# EAGLE schematic EEZ CF-DIC r4B4 (EAGLE 7.2.0)
Assembly variants: Farnell, TME

## Sheet 1 of 3
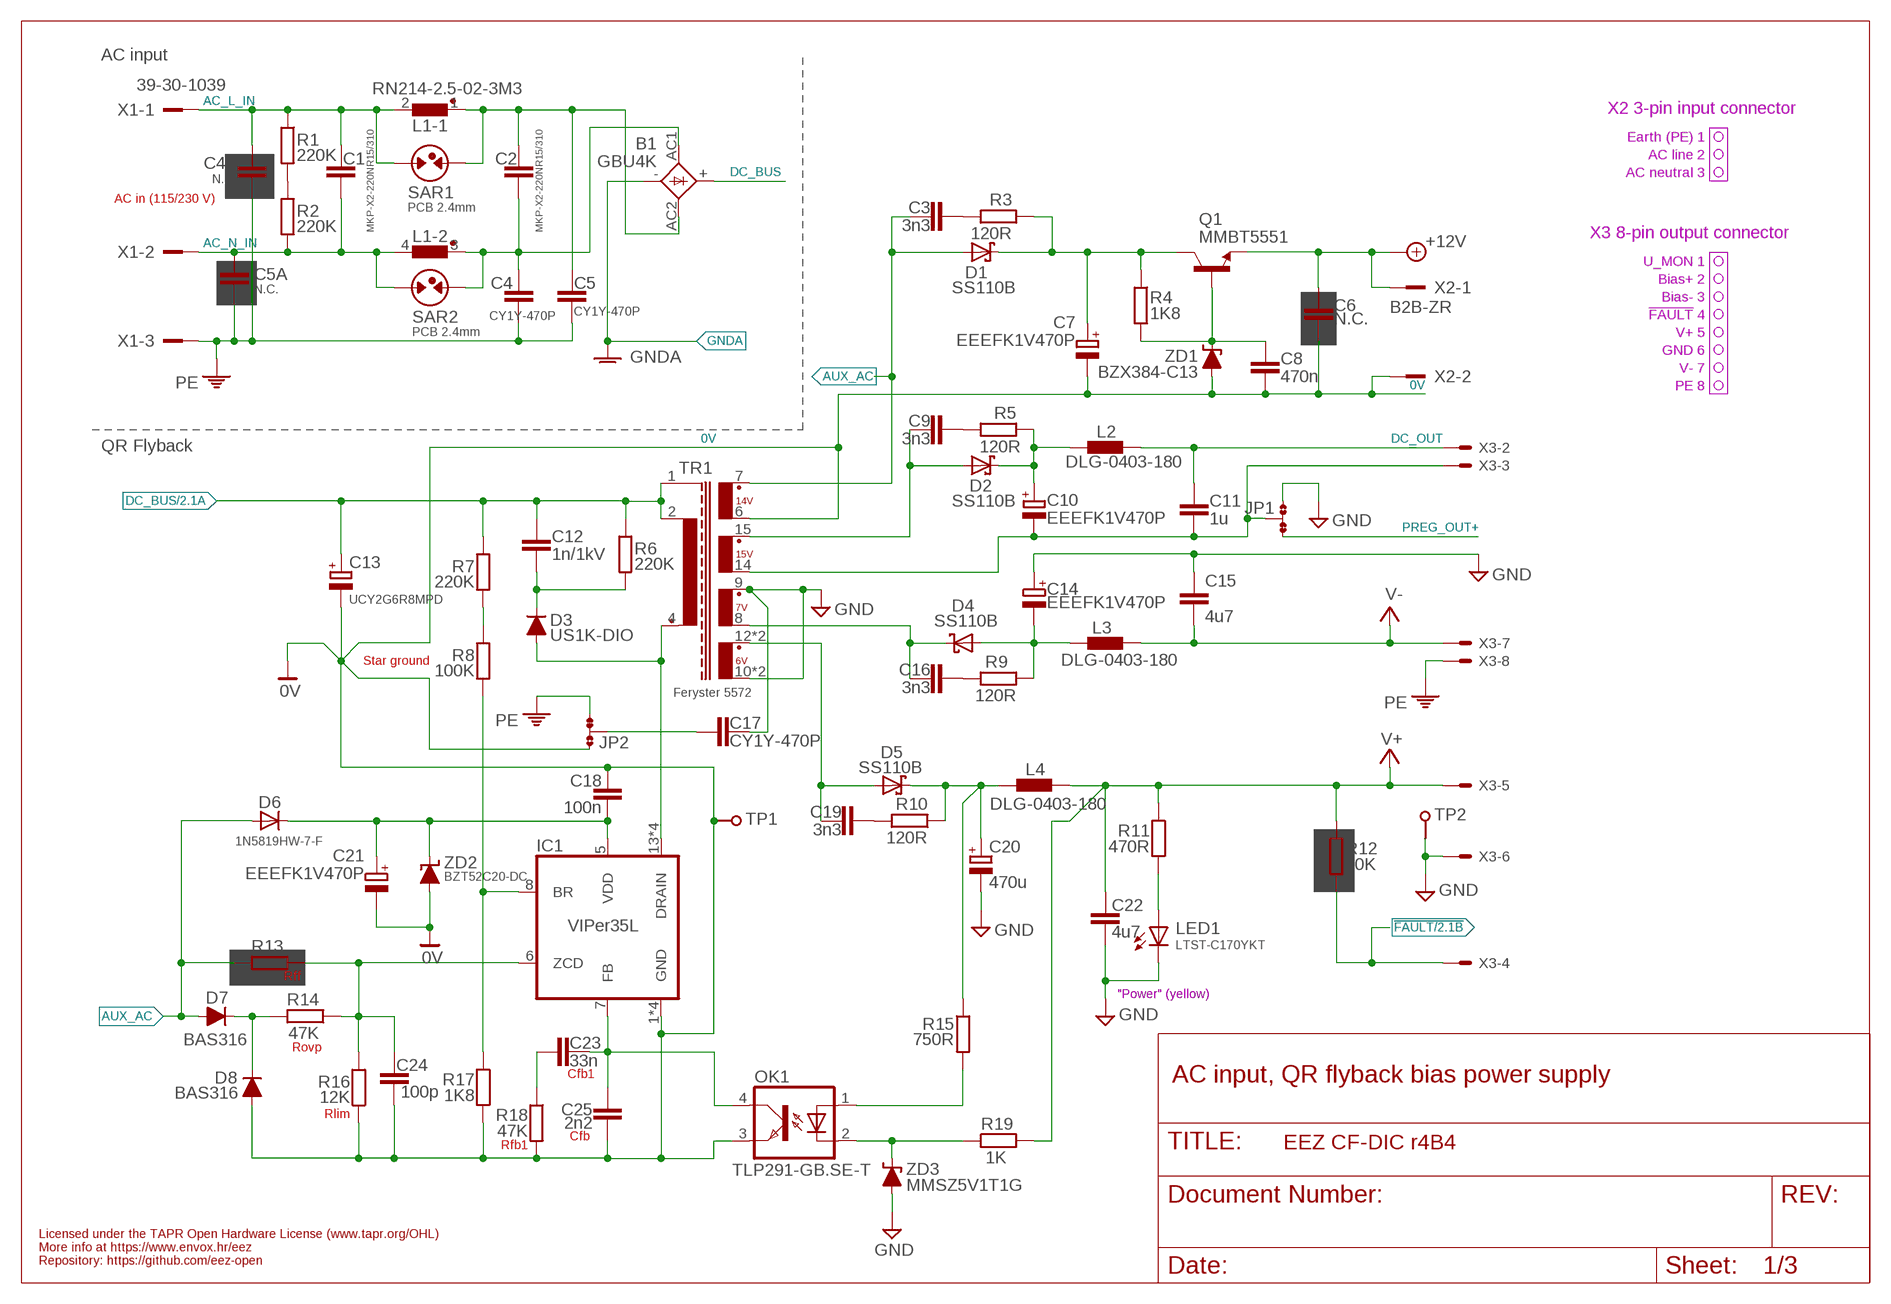
[diagram p0: schematic, sheet 1]

### Parts
B1  GBU4K  BRIDGE-CREEPAGE  [GBU4K_CRE]
C1  MKP-X2-220NR15/310  C-EU150-072X183  [C150-072X183]
C2  MKP-X2-220NR15/310  C-EU150-072X183  [C150-072X183]
C3  3n3  C-EUC0805  [C0805]
C4  CY1Y-470P  C-EUCY  [CY075-032X103]
C4A  N.C.  C-EUCY  [CY075-032X103]
C5  CY1Y-470P  C-EUCY  [CY075-032X103]
C5A  N.C.  C-EUCY  [CY075-032X103]
C6  N.C.  C-EUC0603  [C0603]
C7  EEEFK1V470P  ECAPPANASONIC_H  [CAPAE660X610N]
C8  470n  C-EUC0805  [C0805]
C9  3n3  C-EUC0805  [C0805]
C10  EEEFK1V470P  ECAPPANASONIC_H  [CAPAE660X610N]
C11  1u  C-EUC0805  [C0805]
C12  1n/1kV  C-EUC1210  [C1210]
C13  UCY2G6R8MPD  ECAP5G_10.5MM  [ECAP5/10.5]
C14  EEEFK1V470P  ECAPPANASONIC_H  [CAPAE660X610N]
C15  4u7  C-EUC1206  [C1206]
C16  3n3  C-EUC0805  [C0805]
C17  CY1Y-470P  C-EUCY  [CY075-032X103]
C18  100n  C-EUC0603  [C0603]
C19  3n3  C-EUC0805  [C0805]
C20  470u  ECAP5G_10.5MM  [ECAP5/10.5]
C21  EEEFK1V470P  ECAPPANASONIC_H  [CAPAE660X610N]
C22  4u7  C-EUC1206  [C1206]
C23  33n  C-EUC0805  [C0805]
C24  100p  C-EUC0805  [C0805]
C25  2n2  C-EUC0805  [C0805]
D1  SS110B  SCHOTTKYSMB  [SMB]
D2  SS110B  SCHOTTKYSMB  [SMB]
D3  US1K-DIO  DIODEDO214AA  [DO214AA]
D4  SS110B  SCHOTTKYSMB  [SMB]
D5  SS110B  SCHOTTKYSMB  [SMB]
D6  1N5819HW-7-F  DIODE-SOD323-W  [SOD323-W]
D7  BAS316  DIODESOD323R  [SOD323-R]
D8  BAS316  DIODESOD323R  [SOD323-R]
IC1  VIPer35L  VIPER35  [SOIC-16]
JP1  JP3-CUT  [JP3-CUT]
JP2  JP3-CUT  [JP3-CUT]
L1  RN214-2.5-02-3M3  RN214  [RN214]
L2  DLG-0403-180  DE0403  [DE0403]
L3  DLG-0403-180  DE0403  [DE0403]
L4  DLG-0403-180  DE0403  [DE0403]
LED1  LTST-C170YKT  LED0805  [LED_0805]
OK1  TLP291-GB.SE-T  TLP291  [SO4]
Q1  MMBT5551  MMBT5551LT1-NPN-SOT23-BEC  [SOT23-BEC]
R1  220K  R-EU_R1206  [R1206]
R2  220K  R-EU_R1206  [R1206]
R3  120R  R-EU_R0805  [R0805]
R4  1K8  R-EU_R0805  [R0805]
R5  120R  R-EU_R0805  [R0805]
R6  220K  R-EU_R1206  [R1206]
R7  220K  R-EU_R1206  [R1206]
R8  100K  R-EU_R0805  [R0805]
R9  120R  R-EU_R0805  [R0805]
R10  120R  R-EU_R0805  [R0805]
R11  470R  R-EU_R0805  [R0805]
R12  10K  R-EU_R0805  [R0805]
R13  N.C.  R-EU_R0805  [R0805]
R14  47K  R-EU_R0805  [R0805]
R15  750R  R-EU_R0805  [R0805]
R16  12K  R-EU_R0805  [R0805]
R17  1K8  R-EU_R0805  [R0805]
R18  47K  R-EU_R0805  [R0805]
R19  1K  R-EU_R0805  [R0805]
SAR1  PCB 2.4mm  SARPCB-2.4MM  [PCB-SAR_2.4MM]
SAR2  PCB 2.4mm  SARPCB-2.4MM  [PCB-SAR_2.4MM]
TP1  PCB_TEST_TABSHIELD  [PCB_SHIELD_TAB]
TP2  PCB_TEST_TABSHIELD  [PCB_SHIELD_TAB]
TR1  Feryster 5572  FERYSTER_5572  [FERYSTER_5572]
X1  39-30-1039  MINIFIT_39301039-CREEPAGE  [MINIFIT_39301039_CRE]
X2  B2B-ZR  [B2B-ZR]
X3  90136-1208  C-GRID-08-70543  [70543-08]
ZD1  BZX384-C13  ZENER-DIODESOD323  [SOD323-W]
ZD2  BZT52C20-DC  ZENER-DIODESOD123  [SOD123]
ZD3  MMSZ5V1T1G  ZENER-DIODESOD323  [SOD323-W]

### Nets
0V: C6.2 C7.2(-) C8.2 C13.- C18.1 C21.2(-) C24.2 C25.2 D8.A IC1.1(GND) IC1.2(GND) IC1.3(GND) IC1.4(GND) JP2.NO OK1.3(EMIT) R16.1 R17.2 R18.2 TP1.1 TR1.6(S_BIAS) X2.2 ZD1.A ZD2.A ; also sheet 2,3
6VAC: C19.2 D5.A TR1.12(S1_DOT) TR1.13(S1_DOT)
7VAC: C16.2 D4.C TR1.8(S2)
15VAC: C9.2 D2.A TR1.15(S3_DOT)
!FAULT: R12.2 X3.4 ; also sheet 2
+6V_REC: C20.+ D5.C L4.1 R10.1 R15.1
+12V: C6.1 Q1.E X2.1 ; also sheet 2
+15V_REC: C10.1(+) D2.C L2.1 R5.1
-7V_REC: C14.2(-) D4.A L3.1 R9.1
-15V: C10.2(-) C11.2 JP1.COM TR1.14(S3) X3.3
AC_L_IN: C1.1 C4A.2 L1.2 R1.1 SAR1.1 X1.1
AC_N_IN: C1.2 C5A.2 L1.4 R2.2 SAR2.1 X1.2
AUX_AC: C3.2 D1.A D6.A D7.A R13.2 TR1.7(S_BIAS_DOT)
AUX_REC: C7.1(+) D1.C Q1.C R3.1 R4.1
DC_BUS: B1.+ C12.1 C13.+ R6.1 R7.1 TR1.1(SHIELD) TR1.2(P) ; also sheet 2
DC_OUT: C11.1 L2.2 X3.2
FB2: OK1.2(C) R19.1 ZD3.C
GND: C14.1(+) C15.1 C17.2 C20.- C22.2 JP1.NO LED1.C TP2.1 TR1.9(S2_DOT) TR1.10(S1) TR1.11(S1) X3.6 ZD3.A ; also sheet 2,3
GNDA: B1.- ; also sheet 2
N$4: C17.1 JP2.COM
N$11: LED1.A R11.2
N$15: B1.AC2 C2.1 C5.2 L1.1 SAR1.2
N$20: IC1.8(BR) R8.2 R17.1
N$24: B1.AC1 C2.2 C4.2 L1.3 SAR2.2
N$27: C18.2 C21.1(+) D6.C IC1.5(VDD) ZD2.C
N$33: R1.2 R2.1
N$49: R7.2 R8.1
N$133: C8.1 Q1.B R4.2 ZD1.C
N$135: OK1.1(A) R15.2
N$137: C12.2 D3.C R6.2
N$138: C23.2 C25.1 IC1.7(FB) OK1.4(COL)
N$139: C9.1 R5.2
N$140: C3.1 R3.2
N$141: C24.1 IC1.6(ZCD) R13.1 R14.1 R16.2
N$144: C16.1 R9.2
N$146: C19.1 R10.2
N$152: C23.1 R18.1
N$155: D7.C D8.C R14.2
PE: C4.1 C4A.1 C5.1 C5A.1 JP2.NC X1.3 X3.8
PREG_OUT+: JP1.NC ; also sheet 3
V+: C22.1 L4.2 R11.1 R12.1 R19.2 X3.5 ; also sheet 3
V-: C15.2 L3.2 X3.7 ; also sheet 3
VIPER_D: D3.A IC1.13(DRAIN) IC1.14(DRAIN) IC1.15(DRAIN) IC1.16(DRAIN) TR1.4(P2_DOT)

### Notes on the sheet
- AC input
- X2 3-pin input connector
- Earth (PE) 1
- AC line 2
- AC neutral 3
- AC in (115/230 V)
- X3 8-pin output connector
- U_MON 1
- Bias+ 2
- Bias- 3
- !FAULT! 4
- V+ 5
- GND 6
- V- 7
- PE 8
- QR Flyback
- Star ground
- Rff
- "Power" (yellow)
- Rovp
- Cfb1
- AC input, QR flyback bias power supply
- Rlim
- Cfb
- Rfb1
- Licensed under the TAPR Open Hardware License (www.tapr.org/OHL)
- More info at https://www.envox.hr/eez
- Repository: https://github.com/eez-open

## Sheet 2 of 3
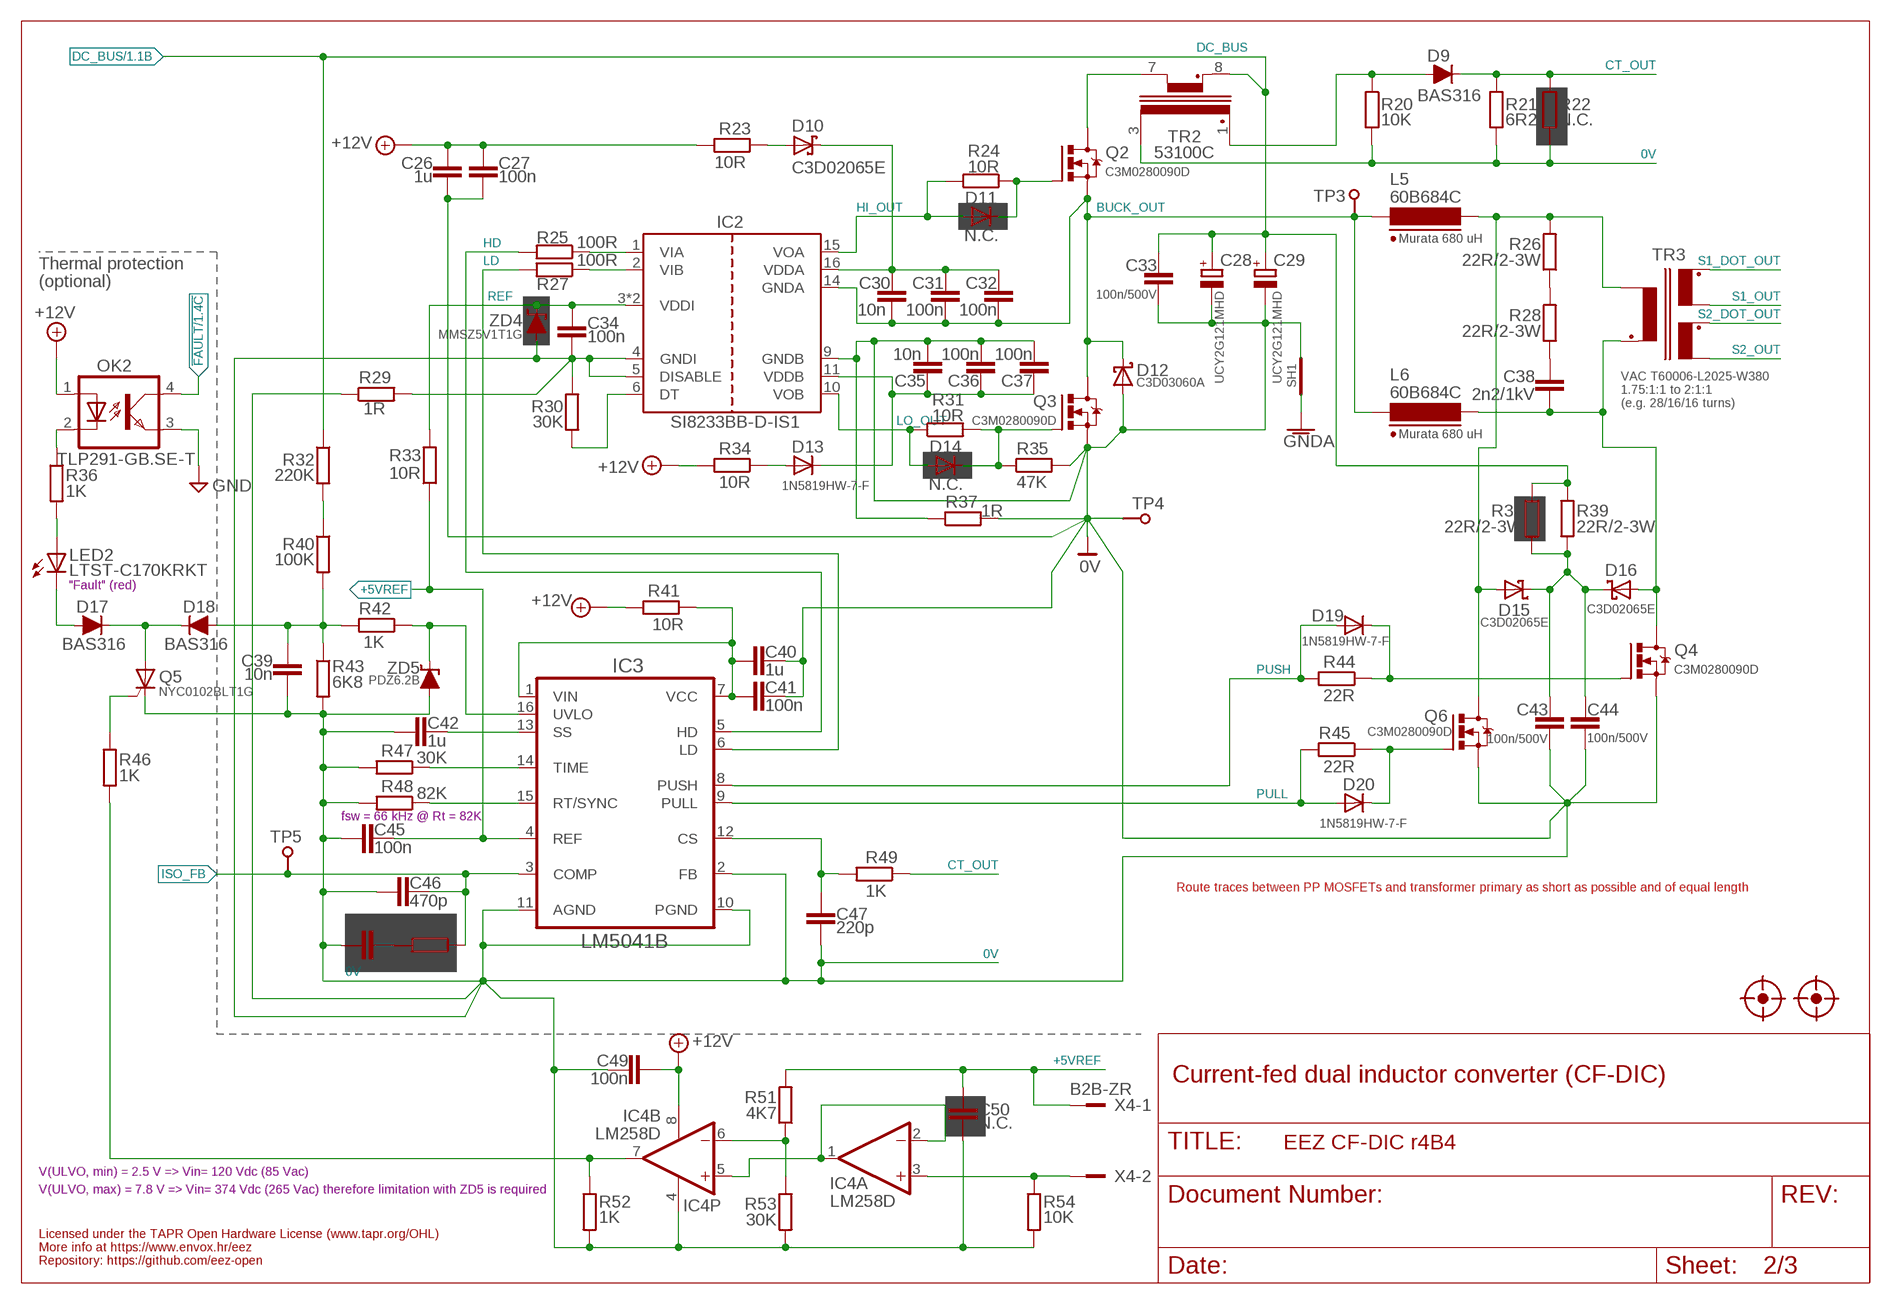
[diagram p1: schematic, sheet 2]

### Parts
C26  1u  C-EUC0805  [C0805]
C27  100n  C-EUC0603  [C0603]
C28  UCY2G121MHD  ECAP7.5G_18MM  [ECAP7.5/18]
C29  UCY2G121MHD  ECAP7.5G_18MM  [ECAP7.5/18]
C30  10n  C-EUC0603  [C0603]
C31  100n  C-EUC0603  [C0603]
C32  100n  C-EUC0603  [C0603]
C33  100n/500V  C-EUC1812  [C1812]
C34  100n  C-EUC0603  [C0603]
C35  10n  C-EUC0603  [C0603]
C36  100n  C-EUC0603  [C0603]
C37  100n  C-EUC0603  [C0603]
C38  2n2/1kV  C-EUC1210  [C1210]
C39  10n  C-EUC0603  [C0603]
C40  1u  C-EUC0805  [C0805]
C41  100n  C-EUC0603  [C0603]
C42  1u  C-EUC0805  [C0805]
C43  100n/500V  C-EUC1812  [C1812]
C44  100n/500V  C-EUC1812  [C1812]
C45  100n  C-EUC0603  [C0603]
C46  470p  C-EUC0805  [C0805]
C47  220p  C-EUC0805  [C0805]
C48  N.C.  C-EUC0805  [C0805]
C49  100n  C-EUC0603  [C0603]
C50  N.C.  C-EUC0603  [C0603]
D9  BAS316  DIODESOD323R  [SOD323-R]
D10  C3D02065E  SCHOTTKY-SIC  [TO252]
D11  N.C.  DIODE-SOD323-W  [SOD323-W]
D12  C3D03060A  SCHOTTKY-TO220  [TO220-2]
D13  1N5819HW-7-F  DIODE-SOD323-W  [SOD323-W]
D14  N.C.  DIODE-SOD323-W  [SOD323-W]
D15  C3D02065E  SCHOTTKY-SIC  [TO252]
D16  C3D02065E  SCHOTTKY-SIC  [TO252]
D17  BAS316  DIODESOD323R  [SOD323-R]
D18  BAS316  DIODESOD323R  [SOD323-R]
D19  1N5819HW-7-F  DIODE-SOD323-W  [SOD323-W]
D20  1N5819HW-7-F  DIODE-SOD323-W  [SOD323-W]
FM1  FIDUCIAL_2  [FIDUCIAL_DUAL]
FM2  FIDUCIAL_2  [FIDUCIAL_DUAL]
IC2  SI8233BB-D-IS1  SI8233  [SOIC-16]
IC3  LM5041B  LM5041  [MTC16]
IC4  LM258D  TL072SOIC8  [SOIC127P600X173-8N]
L5  60B684C  MURATA_6000B  [MURATA_6000B]
L6  60B684C  MURATA_6000B  [MURATA_6000B]
LED2  LTST-C170KRKT  LED0805  [LED_0805]
OK2  TLP291-GB.SE-T  TLP291  [SO4]
Q2  C3M0280090D  N-MOSFETTO247  [TO247BV-ROUND]
Q3  C3M0280090D  N-MOSFETTO247  [TO247BV-ROUND]
Q4  C3M0280090D  N-MOSFETTO247  [TO247BV-ROUND]
Q5  NYC0102BLT1G  [SOT23]
Q6  C3M0280090D  N-MOSFETTO247  [TO247BV-ROUND]
R20  10K  R-EU_R0805  [R0805]
R21  6R2  R-EU_R0805  [R0805]
R22  N.C.  R-EU_R0805  [R0805]
R23  10R  R-EU_R0805  [R0805]
R24  10R  R-EU_R0805  [R0805]
R25  100R  R-EU_R0805  [R0805]
R26  22R/2-3W  R-EU_R2512  [R2512]
R27  100R  R-EU_R0805  [R0805]
R28  22R/2-3W  R-EU_R2512  [R2512]
R29  1R  R-EU_R0805  [R0805]
R30  30K  R-EU_R0805  [R0805]
R31  10R  R-EU_R0805  [R0805]
R32  220K  R-EU_R1206  [R1206]
R33  10R  R-EU_R0805  [R0805]
R34  10R  R-EU_R0805  [R0805]
R35  47K  R-EU_R0805  [R0805]
R36  1K  R-EU_R0805  [R0805]
R37  1R  R-EU_R0805  [R0805]
R38  22R/2-3W  R-EU_R2512  [R2512]
R39  22R/2-3W  R-EU_R2512  [R2512]
R40  100K  R-EU_R0805  [R0805]
R41  10R  R-EU_R0805  [R0805]
R42  1K  R-EU_R0805  [R0805]
R43  6K8  R-EU_R0805  [R0805]
R44  22R  R-EU_R0805  [R0805]
R45  22R  R-EU_R0805  [R0805]
R46  1K  R-EU_R0805  [R0805]
R47  30K  R-EU_R0805  [R0805]
R48  82K  R-EU_R0805  [R0805]
R49  1K  R-EU_R0805  [R0805]
R50  N.C.  R-EU_R0805  [R0805]
R51  4K7  R-EU_R0805  [R0805]
R52  1K  R-EU_R0805  [R0805]
R53  30K  R-EU_R0805  [R0805]
R54  10K  R-EU_R0805  [R0805]
SH1  SHORTNOHOLE  [SHORT_NOHOLE]
TP3  PCB_TEST_TABSHIELD  [PCB_SHIELD_TAB]
TP4  PCB_TEST_TABSHIELD  [PCB_SHIELD_TAB]
TP5  PCB_TEST_TABSHIELD  [PCB_SHIELD_TAB]
TR2  53100C  MURATA_5300  [MURATA_5300]
TR3  VAC T60006-L2025-W380  PCB_TRAFO_FLYBACK2-VAC  [VAC_DUAL_SEC]
X4  B2B-ZR  [B2B-ZR]
ZD4  MMSZ5V1T1G  ZENER-DIODESOD323  [SOD323-W]
ZD5  PDZ6.2B  ZENER-DIODESOD323  [SOD323-W]

### Nets
0V: C26.1 C27.1 C28.- C29.- C33.1 C34.1 C35.2 C36.2 C37.2 C39.2 C40.2 C41.2 C42.1 C43.1 C44.1 C45.1 C46.1 C47.1 C48.1 C49.2 C50.2 D12.2(A) IC2.4(GNDI) IC2.5(DISABLE) IC2.9(GNDB) IC3.2(FB) IC3.10(PGND) IC3.11(AGND) IC4.4(P:V-) Q3.S Q4.S Q5.1(C) Q6.S R20.2 R21.2 R22.2 R29.1 R29.2 R30.1 R35.2 R37.1 R37.2 R43.2 R47.2 R48.2 R52.2 R53.2 R54.2 SH1.P$2(GND_B) TP4.1 TR2.3(S) ZD4.A ZD5.A ; also sheet 1,3
!FAULT: OK2.4(COL) ; also sheet 1
+5VREF: C45.2 C50.1 IC3.4(REF) R33.1 R51.2 X4.1
+12V: C26.2 C27.2 C49.1 IC4.8(P:V+) OK2.1(A) R23.2 R34.2 R41.2 ; also sheet 1
BUCK_OUT: C30.2 C31.2 C32.2 D12.1(C) IC2.14(GNDA) L5.2 L6.2 Q2.S Q3.D TP3.1
CLAMP_C: C43.2 C44.2 D15.1(C) D15.3(C) D16.1(C) D16.3(C) R38.1 R39.1
CT_OUT: D9.C R21.1 R22.1 R49.1
DC_BUS: C28.+ C29.+ C33.2 R32.1 R38.2 R39.2 TR2.8(P_DOT) ; also sheet 1
GND: OK2.3(EMIT) ; also sheet 1,3
GNDA: SH1.P$1(GND_A) ; also sheet 1
HD: IC3.5(HD) R25.2
HI_OUT: D11.A IC2.15(VOA) R24.2
ISO_FB: C46.2 IC3.3(COMP) R50.1 TP5.1 ; also sheet 3
L_PULL: D15.2(A) L5.1 Q6.D R26.2 TR3.P1(P)
L_PUSH: C38.2 D16.2(A) L6.1 Q4.D TR3.P1_DOT(P_DOT)
LD: IC3.6(LD) R27.2
LO_OUT: D14.A IC2.10(VOB) R31.1
N$2: R32.2 R40.1
N$3: C30.1 C31.1 C32.1 D10.1(C) D10.3(C) IC2.16(VDDA)
N$5: R26.1 R28.2
N$7: IC4.3(A:+IN) R54.1 X4.2
N$13: D19.C Q4.G R44.1
N$14: D20.C Q6.G R45.1
N$16: LED2.A R36.2
N$17: C38.1 R28.1
N$19: IC3.15(RT/SYNC) R48.1
N$21: D11.C Q2.G R24.1
N$22: IC3.14(TIME) R47.1
N$23: C42.2 IC3.13(SS)
N$25: IC3.16(UVLO) R42.1 ZD5.C
N$26: IC4.6(B:-IN) R51.1 R53.1
N$29: D14.C Q3.G R31.2 R35.1
N$31: D10.2(A) R23.1
N$32: OK2.2(C) R36.1
N$35: C48.2 R50.2
N$36: IC2.1(VIA) R25.1
N$37: C47.2 IC3.12(CS) R49.2
N$38: IC4.7(B:OUT) R46.2 R52.1
N$40: IC2.2(VIB) R27.1
N$42: IC4.1(A:OUT) IC4.2(A:-IN) IC4.5(B:+IN)
N$48: IC2.6(DT) R30.2
N$50: D9.A R20.1 TR2.1(S_DOT)
N$54: C40.1 C41.1 IC3.1(VIN) IC3.7(VCC) R41.1
N$55: C35.1 C36.1 C37.1 D13.C IC2.11(VDDB)
N$56: Q2.D TR2.7(P)
N$63: D13.A R34.1
N$100: Q5.2(G) R46.1
N$126: D17.C D18.C Q5.3(A)
N$130: D17.A LED2.C
PULL: D20.A IC3.9(PULL) R45.2
PUSH: D19.A IC3.8(PUSH) R44.2
REF: C34.2 IC2.3(VDDI) IC2.8(VDDI) R33.2 ZD4.C
S1_DOT_OUT: TR3.S1_DOT ; also sheet 3
S1_OUT: TR3.S1 ; also sheet 3
S2_DOT_OUT: TR3.S2_DOT ; also sheet 3
S2_OUT: TR3.S2 ; also sheet 3
ULVO: C39.1 D18.A R40.2 R42.2 R43.1

### Notes on the sheet
- Murata 680 uH
- Thermal protection
- (optional)
- 1.75:1:1 to 2:1:1
- (e.g. 28/16/16 turns)
- Murata 680 uH
- "Fault" (red)
- fsw = 66 kHz @ Rt = 82K
- Route traces between PP MOSFETs and transformer primary as short as possible and of equal length
- Current-fed dual inductor converter (CF-DIC)
- V(ULVO, min) = 2.5 V => Vin= 120 Vdc (85 Vac)
- V(ULVO, max) = 7.8 V => Vin= 374 Vdc (265 Vac) therefore limitation with ZD5 is required
- Licensed under the TAPR Open Hardware License (www.tapr.org/OHL)
- More info at https://www.envox.hr/eez
- Repository: https://github.com/eez-open

## Sheet 3 of 3
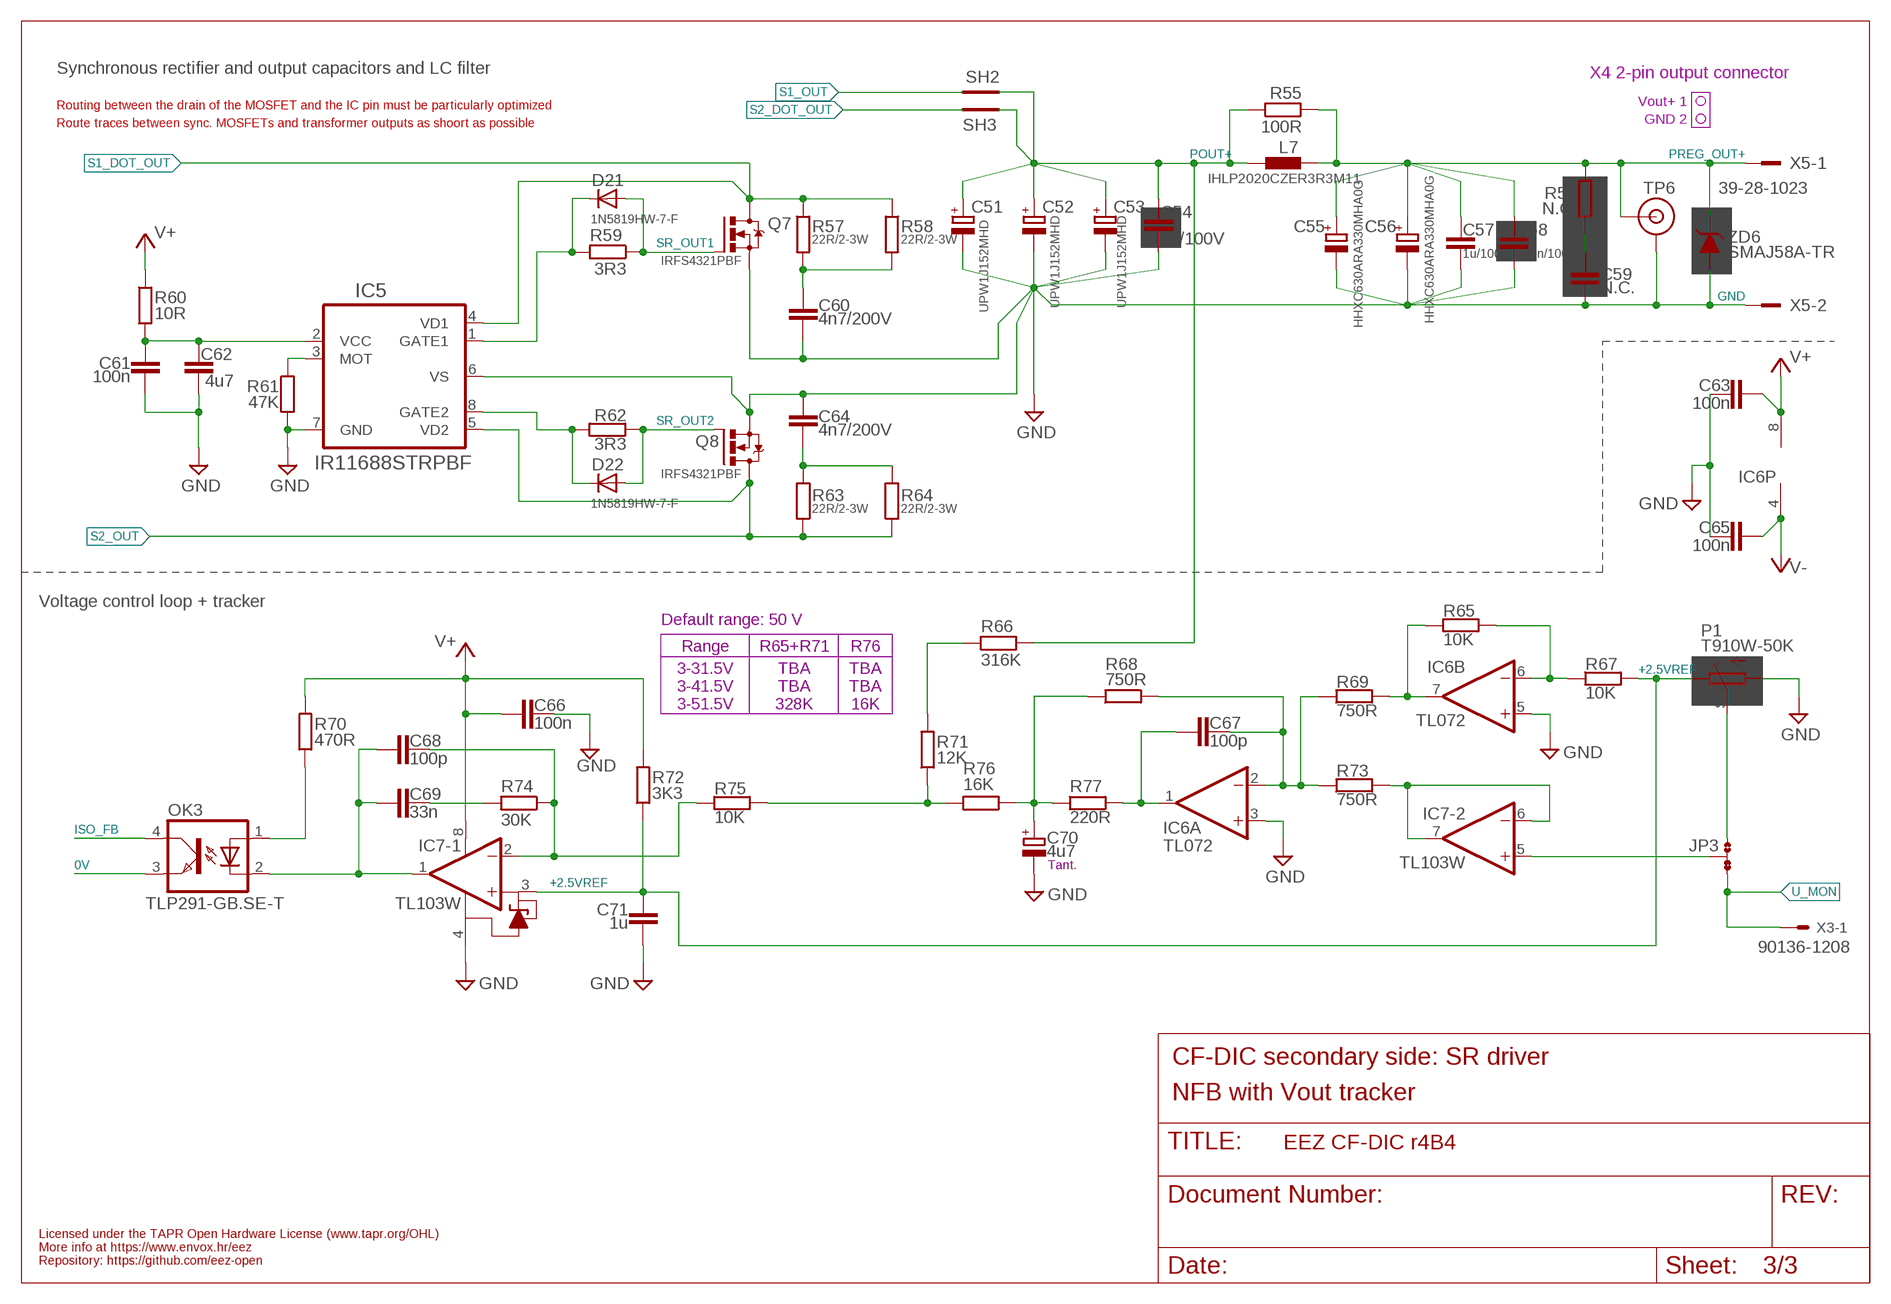
[diagram p2: schematic, sheet 3]

### Parts
C51  UPW1J152MHD  ECAP7.5G_18MM  [ECAP7.5/18]
C52  UPW1J152MHD  ECAP7.5G_18MM  [ECAP7.5/18]
C53  UPW1J152MHD  ECAP7.5G_18MM  [ECAP7.5/18]
C54  1u/100V  C-EUC1206  [C1206]
C55  HHXC630ARA330MHA0G  EEE-FK1J470P-CASE-F  [CAPAE830X1050N]
C56  HHXC630ARA330MHA0G  EEE-FK1J470P-CASE-F  [CAPAE830X1050N]
C57  1u/100V  C-EUC1206  [C1206]
C58  100n/100V  C-EUC0805  [C0805]
C59  N.C.  C-EUC1206  [C1206]
C60  4n7/200V  C-EUC1206  [C1206]
C61  100n  C-EUC0603  [C0603]
C62  4u7  C-EUC1206  [C1206]
C63  100n  C-EUC0603  [C0603]
C64  4n7/200V  C-EUC1206  [C1206]
C65  100n  C-EUC0603  [C0603]
C66  100n  C-EUC0603  [C0603]
C67  100p  C-EUC0805  [C0805]
C68  100p  C-EUC0805  [C0805]
C69  33n  C-EUC0805  [C0805]
C70  4u7  ECAP1206  [EC1206]
C71  1u  C-EUC0805  [C0805]
D21  1N5819HW-7-F  DIODE-SOD323-W  [SOD323-W]
D22  1N5819HW-7-F  DIODE-SOD323-W  [SOD323-W]
IC5  IR11688STRPBF  IR11688  [SO8]
IC6  TL072  TL072SOIC8  [SOIC127P600X173-8N]
IC7  TL103W  [SOIC127P600X173-8N]
JP3  JP3-CUT  [JP3-CUT]
L7  IHLP2020CZER3R3M11  IHLP-2020BZ-11  [IHLP-2020BZ-11]
OK3  TLP291-GB.SE-T  TLP291  [SO4]
P1  T910W-50K  TPOT-S64W  [S64W]
Q7  IRFS4321PBF  N-MOSFETTO263  [TO263]
Q8  IRFS4321PBF  N-MOSFETTO263  [TO263]
R55  100R  R-EU_R0805  [R0805]
R56  N.C.  R-EU_R1210  [R1210]
R57  22R/2-3W  R-EU_R2512  [R2512]
R58  22R/2-3W  R-EU_R2512  [R2512]
R59  3R3  R-EU_R0805  [R0805]
R60  10R  R-EU_R0805  [R0805]
R61  47K  R-EU_R0805  [R0805]
R62  3R3  R-EU_R0805  [R0805]
R63  22R/2-3W  R-EU_R2512  [R2512]
R64  22R/2-3W  R-EU_R2512  [R2512]
R65  10K  R-EU_R0805  [R0805]
R66  316K  R-EU_R0805  [R0805]
R67  10K  R-EU_R0805  [R0805]
R68  750R  R-EU_R0805  [R0805]
R69  750R  R-EU_R0805  [R0805]
R70  470R  R-EU_R0805  [R0805]
R71  12K  R-EU_R0805  [R0805]
R72  3K3  R-EU_R0805  [R0805]
R73  750R  R-EU_R0805  [R0805]
R74  30K  R-EU_R0805  [R0805]
R75  10K  R-EU_R0805  [R0805]
R76  16K  R-EU_R0805  [R0805]
R77  220R  R-EU_R0805  [R0805]
SH2  SHORTNOHOLE  [SHORT_NOHOLE]
SH3  SHORTNOHOLE  [SHORT_NOHOLE]
TP6  TEST_POINT-2  [TP_1.1MM_2]
X5  39-28-1023  MINIFIT_5566-02A  [MINIFIT_5566-02A]
ZD6  SMAJ58A-TR  PSMAXX  [DO214AC]

### Nets
0V: OK3.3(EMIT) ; also sheet 1,2
+2.5VREF: C71.1 IC7.3(-1:+IN1) P1.E R67.2 R72.1
FB: R71.1 R75.2 R76.2
GND: C51.- C52.- C53.- C54.2 C55.2 C56.2 C57.2 C58.2 C59.1 C60.2 C61.2 C62.2 C63.2 C64.2 C65.2 C66.2 C70.- C71.2 IC5.6(VS) IC5.7(GND) IC6.3(A:+IN) IC6.5(B:+IN) IC7.4(-1:VCC-) P1.A Q7.2(S) Q8.2(S) R61.2 TP6.GND X5.2 ZD6.A ; also sheet 1,2
ISO_FB: OK3.4(COL) ; also sheet 2
N$6: C61.1 C62.1 IC5.2(VCC) R60.2
N$8: C59.2 R56.1
N$9: C69.2 R74.2
N$10: C68.2 IC7.2(-1:-IN1) R74.1 R75.1
N$12: R66.1 R71.2
N$18: IC5.3(MOT) R61.1
N$53: IC6.7(B:OUT) R65.1 R69.2
N$57: IC7.5(-2:+IN) JP3.COM
N$58: JP3.NO P1.S
N$64: C67.2 IC6.2(A:-IN) R68.2 R69.1 R73.1
N$66: C60.1 R57.2 R58.2
N$67: C64.1 R63.2 R64.2
N$74: D21.C IC5.1(GATE1) R59.2
N$75: D22.C IC5.8(GATE2) R62.2
N$76: C68.1 C69.1 IC7.1(-1:OUT1) OK3.2(C)
N$132: IC6.6(B:-IN) R65.2 R67.1
N$134: C67.1 IC6.1(A:OUT) R77.2
NFB_OFFSET: C70.+ R68.1 R76.1 R77.1
OK_A: OK3.1(A) R70.1
POUT+: C51.+ C52.+ C53.+ C54.1 L7.1 R55.1 R66.2 SH2.P$2(GND_B) SH3.P$1(GND_A)
PREG_OUT+: C55.1 C56.1 C57.1 C58.1 L7.2 R55.2 R56.2 TP6.TIP X5.1 ZD6.C ; also sheet 1
S1_DOT_OUT: IC5.4(VD1) Q7.3(D) R57.1 R58.1 ; also sheet 2
S1_OUT: SH2.P$1(GND_A) ; also sheet 2
S2_DOT_OUT: SH3.P$2(GND_B) ; also sheet 2
S2_OUT: IC5.5(VD2) Q8.3(D) R63.1 R64.1 ; also sheet 2
SR_OUT1: D21.A Q7.1(G) R59.1
SR_OUT2: D22.A Q8.1(G) R62.1
U_MON: JP3.NC X3.1
U_MON1: IC7.6(-2:-IN) IC7.7(-2:OUT) R73.2
V+: C63.1 C66.1 IC6.8(P:V+) IC7.8(-1:VCC+) R60.1 R70.2 R72.2 ; also sheet 1
V-: C65.1 IC6.4(P:V-) ; also sheet 1

### Notes on the sheet
- Synchronous rectifier and output capacitors and LC filter | X4 2-pin output connector
- Vout+ 1
- Routing between the drain of the MOSFET and the IC pin must be particularly optimized
- GND 2
- Route traces between sync. MOSFETs and transformer outputs as shoort as possible
- Voltage control loop + tracker
- Default range: 50 V
- Range | R65+R71 | R76
- 3-31.5V | TBA | TBA
- 3-41.5V | TBA | TBA
- 3-51.5V | 328K | 16K
- Tant.
- CF-DIC secondary side: SR driver
- NFB with Vout tracker
- Licensed under the TAPR Open Hardware License (www.tapr.org/OHL)
- More info at https://www.envox.hr/eez
- Repository: https://github.com/eez-open

## Library data of the parts
B1 = EEZ_Lib1:BRIDGE
C1-C3 C6 C8 C9 C11 C12 C15 C16 C18 C19 C22-C27 C30-C50 C54 C57-C69 C71 = rcl:C-EU: CAPACITOR, European symbol
C4 C4A C5 C5A C17 = EEZ_Lib1:C-EU
C7 C10 C13 C14 C20 C21 C28 C29 C51-C53 C70 = EEZ_Lib1:ECAP
C55 C56 = Panasonic-EEEFK_EEEFP:EEE-: Aluminum Electrolytic Capacitors,Surface Mount Type; MPN: EEE-FK1J470P; OC_FARNELL: 9696032; OC_NEWARK: 96K9403; PACKAGE: CASE-F; SUPPLIER: PANASONIC; TOLERANCE: ±20 %; VALUE: 47UF; VOLTAGERATING: 63 V
D1 D2 D4 D5 D10 D12 D15 D16 = EEZ_Lib1:SCHOTTKY
D3 D7-D9 D17 D18 = EEZ_Lib1:DIODE
D6 D11 D13 D14 D19-D22 = diode:DIODE-: DIODE
FM1 FM2 = EEZ_Lib1:FIDUCIAL: Fiducial mark for pick and place automation
IC1 = EEZ_Lib1:VIPER35: Quasi-resonant high performance off line high voltage converter, 800 V
IC2 = EEZ_Lib1:SI8233: Dual 4.0 Amp ISOdrivers with deadtime control and overlap protection
IC3 = EEZ_Lib1:LM5041: Cascaded PWM Controller; MANUFACTURER_PART_NUMBER: lm5041mtcnopb; VENDOR: TI
IC4 IC6 = EEZ_Lib1:TL072
IC5 = EEZ_Lib1:IR11688: Dual smart rectifier driver IC with programmable MOT
IC7 = EEZ_Lib1:TL103W: Dual Operational Amplifiers With Internal Reference
JP1-JP3 = EEZ_Lib1:JP3-CUT: 2-way SMT jumper with one position connected
L1 = EEZ_inductors_and_transformers:RN214: Schaffner EMC/EMI current-compensated chokes, vertical case; FARNELL: 1191518
L2-L4 = EEZ_inductors_and_transformers:DE0403: Ferrocore SMD power coil 4.0 x 4.5 mm
L5 L6 = EEZ_inductors_and_transformers:MURATA_6000B: Surface Mount Power Inductors (47μH to 680μH)
L7 = EEZ_inductors_and_transformers:IHLP-2020BZ-11: Low Profile, High Current IHLP® Inductors
LED1 LED2 = EEZ_Lib1:LED
OK1-OK3 = EEZ_Lib1:TLP291: Toshiba Photocopler GaAs IRED & Photo-transistor
P1 = EEZ_Lib1:TPOT
Q1 = transistor:*-NPN-: NPN Transistror BF959 corrected 2008.03.06
Q2-Q4 Q6-Q8 = EEZ_Lib1:N-MOSFET
Q5 = EEZ_Lib1:NYC0102BLT1G: Surface Mount Thyristor, High dv/dt, 200V
R1-R77 = rcl:R-EU_: RESISTOR, European symbol
SAR1 SAR2 = EEZ_Lib1:SAR: EPCOS surge arrester EF470X Farnell: 1886596
SH1-SH3 = EEZ_Lib1:SHORT
TP1-TP5 = EEZ_Lib1:PCB_TEST_TAB
TP6 = EEZ_Lib1:TEST_POINT: Test point for oscilloscope probe
TR1 = EEZ_inductors_and_transformers:FERYSTER_5572: Feryster custom for QR Flyback with VIPer35
TR2 = EEZ_inductors_and_transformers:MURATA_5300: 10A Current sensing transformers
TR3 = EEZ_inductors_and_transformers:PCB_TRAFO_FLYBACK2: PCB flyback transformer, dual secondary, no AUX
X1 = EEZ_Lib1:MINIFIT_39301039: MOLEX socket; wire-board; male; Mini-Fit Jr; 4.2mm; PIN:3; THT; PCB snap
X2 X4 = EEZ_Lib1:B2B-ZR: JST Socket; wire-board; male; ZH; 1.5mm; PIN:2; THT; 50V; 1A
X3 = con-molex:C-GRID-08: CONNECTOR wire to board 2.54 mm (0.100") pitch header; OC_FARNELL: unknown; OC_NEWARK: unknown
X5 = EEZ_Lib1:MINIFIT_5566-02A: Molex Socket; wire-board; male; Mini-Fit Jr; 4.2mm; PIN:2; THT; 9A; tinned
ZD1-ZD5 = EEZ_Lib1:ZENER-DIODE
ZD6 = EEZ_Lib1:PSMAXX: Transient Voltage Suppressor, TVS, P4SMA Series, Unidirectional

## Net classes
0 default: width 0.203 mm, drill 0.3 mm, clearance 0.203 mm
1 lvds: width 0.152 mm, drill 0.3 mm, clearance 0.152 mm to class 0, clearance 0.152 mm
2 gnd: width 0.254 mm, drill 0.584 mm, clearance 0.254 mm